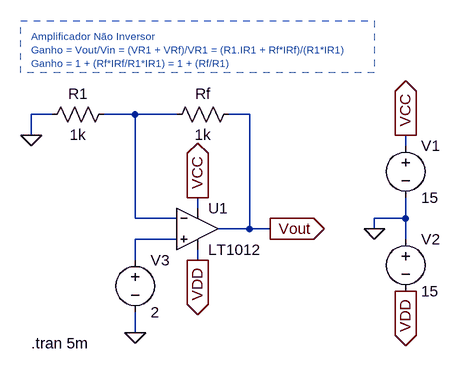
[diagram p0: schematic OpAmp_N_Inv.asc]
OpAmp_N_Inv.asc, the LTspice schematic file:
Version 4
SHEET 1 880 680
WIRE 16 -32 -16 -32
WIRE 144 -32 96 -32
WIRE 208 -32 144 -32
WIRE 320 -32 288 -32
WIRE -16 0 -16 -32
WIRE 560 16 560 0
WIRE 240 112 240 96
WIRE 144 128 144 -32
WIRE 208 128 144 128
WIRE 560 128 560 96
WIRE 560 128 512 128
WIRE 320 144 320 -32
WIRE 320 144 272 144
WIRE 352 144 320 144
WIRE 512 144 512 128
WIRE 208 160 144 160
WIRE 560 160 560 128
WIRE 144 192 144 160
WIRE 240 192 240 176
WIRE 144 304 144 272
FLAG 512 144 0
FLAG 560 0 VCC
IOPIN 560 0 Out
FLAG 560 240 VDD
IOPIN 560 240 Out
FLAG 240 96 VCC
IOPIN 240 96 Out
FLAG 240 192 VDD
IOPIN 240 192 Out
FLAG 352 144 Vout
IOPIN 352 144 Out
FLAG 144 304 0
FLAG -16 0 0
SYMBOL Opamps\\LT1012 240 80 R0
SYMATTR InstName U1
SYMBOL voltage 560 0 R0
SYMATTR InstName V1
SYMATTR Value 15
SYMBOL voltage 560 144 R0
SYMATTR InstName V2
SYMATTR Value 15
SYMBOL res 112 -48 R90
WINDOW 0 0 56 VBottom 2
WINDOW 3 32 56 VTop 2
SYMATTR InstName R1
SYMATTR Value 1k
SYMBOL res 304 -48 R90
WINDOW 0 0 56 VBottom 2
WINDOW 3 32 56 VTop 2
SYMATTR InstName Rf
SYMATTR Value 1k
SYMBOL voltage 144 176 R0
SYMATTR InstName V3
SYMATTR Value 2
TEXT -16 320 Left 2 !.tran 5m
TEXT -16 -152 Left 1 ;Amplificador Não Inversor\nGanho = Vout/Vin = (VR1 + VRf)/VR1 = (R1.IR1 + Rf*IRf)/(R1*IR1)\nGanho = 1 + (Rf*IRf/R1*IR1) = 1 + (Rf/R1)
RECTANGLE Normal 512 -96 -32 -176 2

The netlist it stands for:
* OpAmp_N_Inv.asc
XU1 N002 N001 VCC VDD Vout LT1012  ; pins In+ In- V+ V- OUT
V1 VCC 0 15
V2 0 VDD 15
R1 N001 0 1k
Rf Vout N001 1k
V3 N002 0 2
.tran 5m
* Amplificador Não Inversor
* Ganho = Vout/Vin = (VR1 + VRf)/VR1 = (R1.IR1 + Rf*IRf)/(R1*IR1)
* Ganho = 1 + (Rf*IRf/R1*IR1) = 1 + (Rf/R1)
.backanno
.end